# Altium schematic sheet Supply.SchDoc
size A4
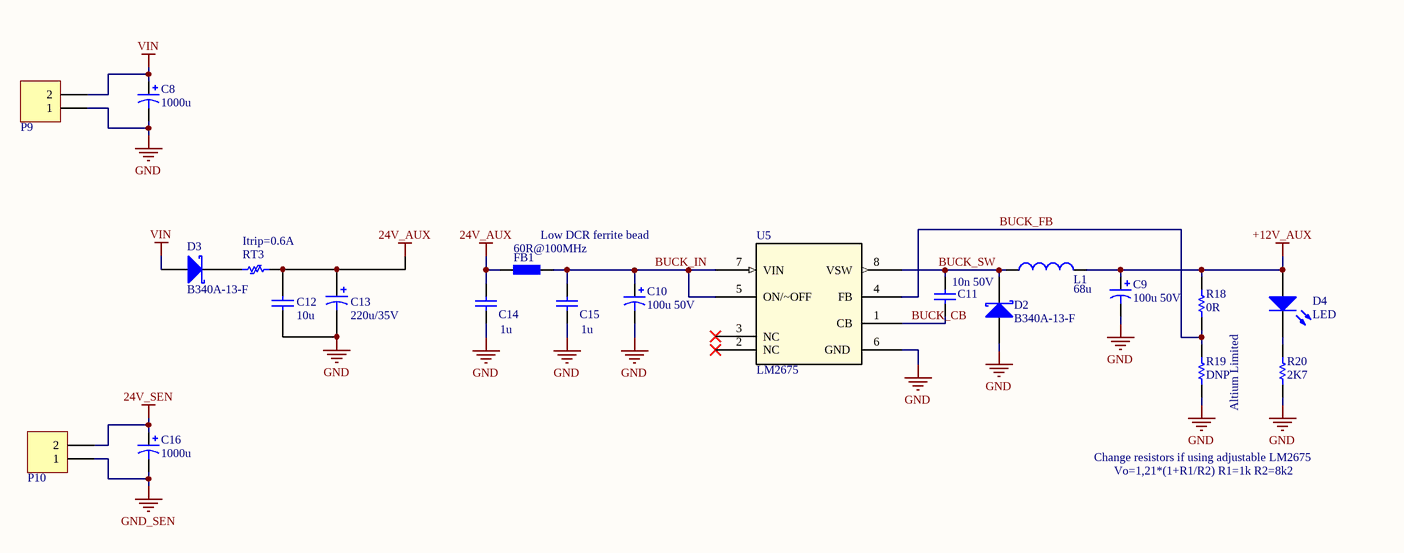
[diagram p0: Supply.SchDoc]

## Parts
C8  value 1000u  [CAP_P10MM-D22MM]  (hidden comment: Cap Pol2)
C9  value 100u 50V  [FKV Panasonic 6.3x7.7L (D8)]  (hidden comment: Cap Pol2)
C10  value 100u 50V  [FKV Panasonic 6.3x7.7L (D8)]  (hidden comment: Cap Pol2)
C11  value 10n 50V  [SMD_CAP_0805]  (hidden comment: Capacitor)
C12  value 10u  [SMT1210_M]  (hidden comment: X7R/1210/50V)
C13  value 220u/35V  [FKV Panasonic 8x10.2L (F)]  (hidden comment: 8x10.2)
C14  value 1u  [SMT0805_M]  (hidden comment: Capacitor)
C15  value 1u  [SMT0805_M]  (hidden comment: Capacitor)
C16  value 1000u  [CAP_P10MM-D22MM]  (hidden comment: Cap Pol2)
D2  B340A-13-F  [SMB]
D3  B340A-13-F  [SMB]
D4  LED  [LED-3mm]
FB1  60R@100MHz  [SMT0805_M]
L1  value 68u  [IND MSS1278 COILCRAFT]  (hidden comment: Inductor)
P9  ECH350V-02P  [ECH350V-02P]  (value not drawn)
P10  ECH350V-02P  [ECH350V-02P]  (value not drawn)
R18  value 0R  [SMD_RES_0805]  (hidden comment: Res)
R19  value DNP  Publisher: Altium Limited  [SMD_RES_0805]  (hidden comment: Res)  (no BOM)
R20  value 2K7  [SMT0805_M]  (hidden comment: Res)
RT3  Itrip=0.6A  [AXIAL-0.2]
U5  LM2675  [SOIC-8-M]

## Nets
24V_AUX: C12.2 C13.1 C14.2 FB1.1 RT3.1
24V_SEN: C16.1 P10.2
+12V_AUX: C9.1 D4.1(A) L1.2 R18.1
GND: C8.2 C9.2 C10.2 C12.1 C13.2 C14.1 C15.1 D2.1(A) P9.1 R19.2 R20.1 U5.6(GND)
GND_SEN: C16.2 P10.1
VIN: C8.1 D3.1(A) P9.2
BUCK_CB: C11.1 U5.1(CB)
BUCK_FB: R18.2 R19.1 U5.4(FB)
BUCK_IN: C10.1 C15.2 FB1.2 U5.5(ON/~OFF) U5.7(VIN)
BUCK_SW: C11.2 D2.2(K) L1.1 U5.8(VSW)
NetD3_2: D3.2(K) RT3.2
NetD4_2: D4.2(K) R20.2

Not connected (* = marked no-connect by the designer): U5 2(NC)* 3(NC)*

## Notes on the sheet
- (near FB1) Low DCR ferrite bead
- Change resistors if using adjustable LM2675
- Vo=1,21*(1+R1/R2) R1=1k R2=8k2

## Library data of the parts
C8-C10 C16 = Cap Pol2: Polarized Capacitor (Axial); Published: 8-Jun-2000; LatestRevisionDate: 17-Jul-2002; LatestRevisionNote: Re-released for DXP Platform.; PackageReference: POLAR0.8; Publisher: Altium Limited; PackageDescription: Polarized Capacitor; 2 Leads
C12 = Cap: Capacitor; PN: C3225X7S1H106K; MFT: TDK; Published: 8-Jun-2000; LatestRevisionDate: 17-Jul-2002; LatestRevisionNote: Re-released for DXP Platform.; PackageReference: RAD-0.3; Publisher: Altium Limited; PackageDescription: Radial Cap, Thru-Hole; 2 Leads; 0.3 in Pin Spacing
C13 = Cap Pol1: Polarized Capacitor (Radial); PN: EEEFP1V221AP; MFT: PANASONIC; PN1: EEE-FK1V221P; MFT1: PANASONIC
D2 D3 = D Schottky: Schottky Diode; MFT: DIODES; PN1: MBRA340T3G; MFT1: ON; PN: B340A-13-F
D4 = LED: Typical INFRARED GaAs LED; Published: 8-Jun-2000; LatestRevisionDate: 08-Jul-2005; LatestRevisionNote: Mech Layer 1 removed.; PackageReference: LED-0; Publisher: Altium Limited; PackageDescription: LED; 2 Leads
FB1 = Ferrite Bead
R18-R20 = Res: Resistor; Published: 8-Jun-2000; LatestRevisionDate: 17-Jul-2002; LatestRevisionNote: Re-released for DXP Platform.; PackageReference: AXIAL-0.3; PackageDescription: Axial Device, Thru-Hole; 2 Leads; 0.3 in Pin Spacing
  R18 R20: Publisher: Altium Limited
RT3 = Poly Switch: Thermistor; PN: RXEF030; MFT: BOURNS; Published: 24-Mar-1999; LatestRevisionDate: 29-May-2009; LatestRevisionNote: IPC-7351 Footprint Added.; PackageVersion: Mar-2003; PackageReference: 6-0805; Publisher: Altium Limited; PackageDescription: Chip Resistor 0805 Case Size; Code_IPC: RESC2012
U5 = LM2675: SIMPLE SWITCHER&reg; 6.5V to 40V, 1A Low Component Count Step-Down Regulator 8-SOIC -40 to 125; Manufacturer_Name: Texas Instruments; Manufacturer_Part_Number: LM2675M-12; Type: LM2675M-12; Copyright: Copyright (C) 2025 Ultra Librarian. All rights reserved.; Datasheet: https://www.ti.com/lit/gpn/lm2675; RefDes: RefDes
C11 C14 C15 = Capacitor: Published: 8-Jun-2000; LatestRevisionDate: 17-Jul-2002; LatestRevisionNote: Re-released for DXP Platform.; PackageReference: RAD-0.3; Publisher: Altium Limited; PackageDescription: Radial Cap, Thru-Hole; 2 Leads; 0.3 in Pin Spacing